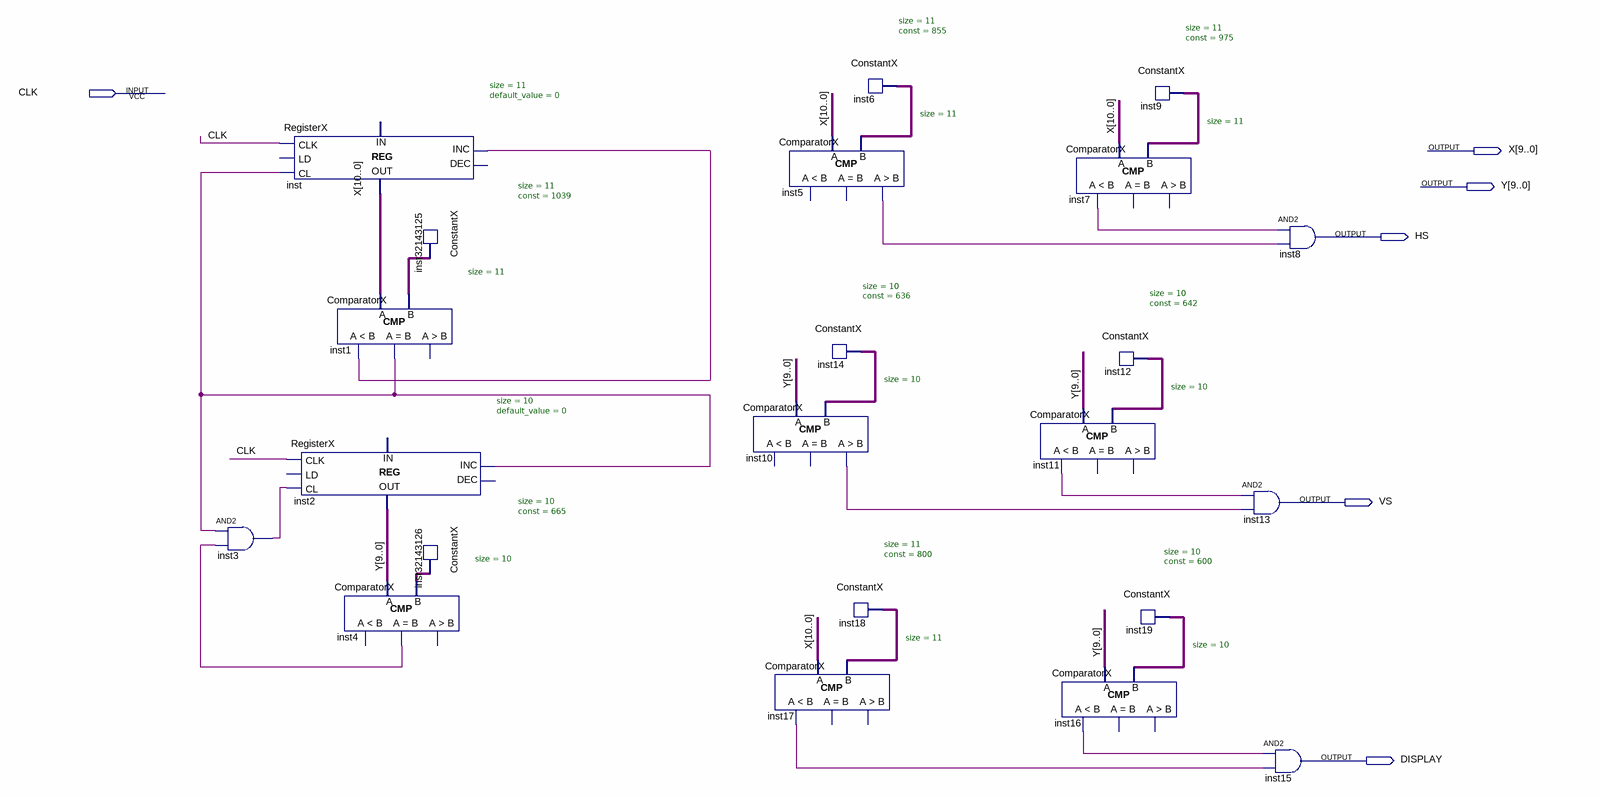
[diagram p0: schematic sheet]
// Quartus schematic Controler.bdf as structural Verilog: 22 symbols, 6 pins
module Controler (
  input  CLK,
  output [10:0] X,
  output [9:0] Y,
  output HS,
  output VS,
  output DISPLAY
);

  wire inst1_eq, inst1_ls, inst3_out, inst4_eq, inst5_gr, inst7_ls, inst10_gr, inst11_ls, inst16_ls,
       inst17_ls;
  wire [9:0] inst12_data_out, inst14_data_out, inst19_data_out, inst32143126_data_out;
  wire [10:0] inst6_data_out, inst9_data_out, inst18_data_out, inst32143125_data_out;

  and inst3 (inst3_out, inst1_eq, inst4_eq);
  RegisterX #(.size(11), .default_value(0)) inst (
    .CLK(CLK), .CL(inst1_eq), .INC(inst1_ls), .DATA_OUT(X));  // open: LD, DEC, DATA_IN
  ComparatorX #(.size(11)) inst1 (.A(X), .B(inst32143125_data_out), .LS(inst1_ls), .EQ(inst1_eq));  // open: GR
  RegisterX #(.size(10), .default_value(0)) inst2 (
    .CLK(CLK), .CL(inst3_out), .INC(inst1_eq), .DATA_OUT(Y));  // open: LD, DEC, DATA_IN
  ComparatorX #(.size(10)) inst4 (.A(Y), .B(inst32143126_data_out), .EQ(inst4_eq));  // open: LS, GR
  ConstantX #(.size(11), .\const (1039)) inst32143125 (.DATA_OUT(inst32143125_data_out));
  ConstantX #(.size(10), .\const (665)) inst32143126 (.DATA_OUT(inst32143126_data_out));
  ComparatorX #(.size(11)) inst5 (.A(X), .B(inst6_data_out), .GR(inst5_gr));  // open: LS, EQ
  ComparatorX #(.size(10)) inst10 (.A(Y), .B(inst14_data_out), .GR(inst10_gr));  // open: LS, EQ
  ComparatorX #(.size(11)) inst17 (.A(X), .B(inst18_data_out), .LS(inst17_ls));  // open: EQ, GR
  ConstantX #(.size(11), .\const (855)) inst6 (.DATA_OUT(inst6_data_out));
  ConstantX #(.size(10), .\const (636)) inst14 (.DATA_OUT(inst14_data_out));
  ConstantX #(.size(11), .\const (800)) inst18 (.DATA_OUT(inst18_data_out));
  ComparatorX #(.size(11)) inst7 (.A(X), .B(inst9_data_out), .LS(inst7_ls));  // open: EQ, GR
  ComparatorX #(.size(10)) inst11 (.A(Y), .B(inst12_data_out), .LS(inst11_ls));  // open: EQ, GR
  ComparatorX #(.size(10)) inst16 (.A(Y), .B(inst19_data_out), .LS(inst16_ls));  // open: EQ, GR
  ConstantX #(.size(11), .\const (975)) inst9 (.DATA_OUT(inst9_data_out));
  ConstantX #(.size(10), .\const (642)) inst12 (.DATA_OUT(inst12_data_out));
  ConstantX #(.size(10), .\const (600)) inst19 (.DATA_OUT(inst19_data_out));
  and inst13 (VS, inst11_ls, inst10_gr);
  and inst8 (HS, inst7_ls, inst5_gr);
  and inst15 (DISPLAY, inst16_ls, inst17_ls);
endmodule
